# Altium schematic sheet MCU.SchDoc: ESP32 Web Radio
size A4; Engineer: CT; SheetNumber: 2; SheetTotal: 5; SPICEModelCacheVHZGYMXH: <root> / <DocumentId>VHZGYMXH</DocumentId> / </root>
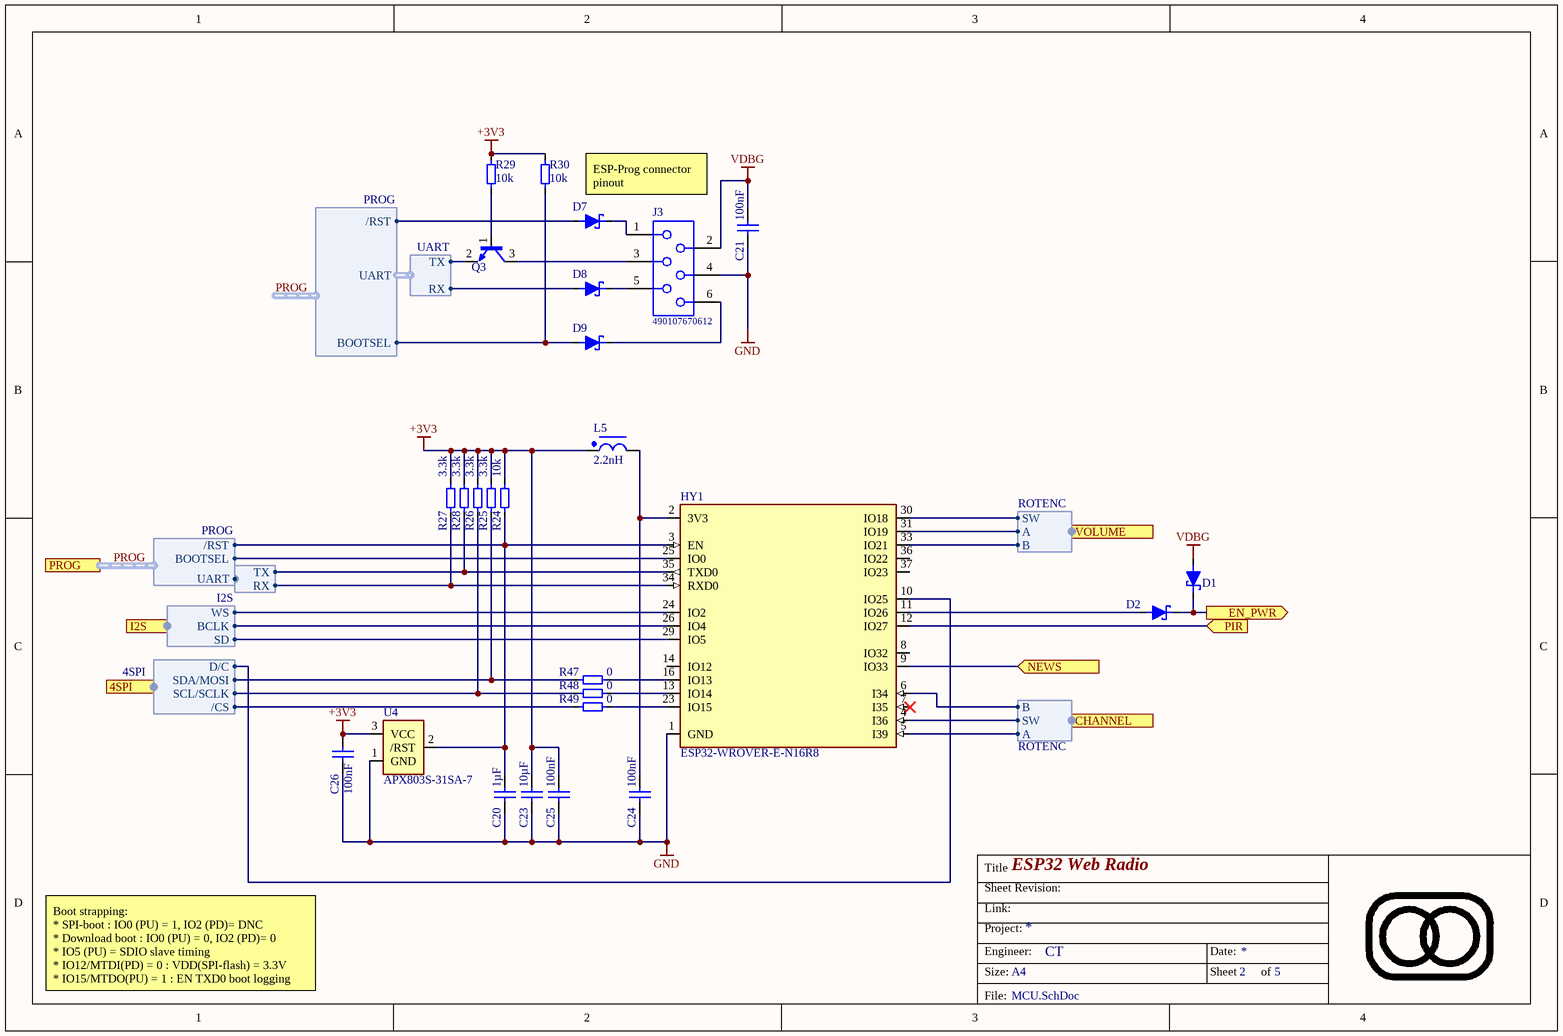
[diagram p0: MCU.SchDoc]

## Parts
C20  value 1µF  [0805-C-N]  (hidden comment: Capacitor 1µF +/-10% 10V X7R 0805)
C21  value 100nF  [0603-C-N]  (hidden comment: Capacitor 100nF +/-10% 50V X7R 0603)
C23  value 10µF  [1206-C-N]  (hidden comment: Capacitor 10µF +/-10% 10V X7R 1206)
C24  value 100nF  [0603-C-N]  (hidden comment: Capacitor 100nF +/-10% 50V X7R 0603)
C25  value 100nF  [0603-C-N]  (hidden comment: Capacitor 100nF +/-10% 50V X7R 0603)
C26  value 100nF  [0603-C-N]  (hidden comment: Capacitor 100nF +/-10% 50V X7R 0603)
D1  1PS79SB30,115  [FP-SOD523-MFG]  (value not drawn)
D2  1PS79SB30,115  [FP-SOD523-MFG]  (value not drawn)
D7  1PS79SB30,115  [FP-SOD523-MFG]  (value not drawn)
D8  1PS79SB30,115  [FP-SOD523-MFG]  (value not drawn)
D9  1PS79SB30,115  [FP-SOD523-MFG]  (value not drawn)
HY1  value ESP32-WROVER-E-N16R8  [ESP32 _WROVER]  (hidden comment: ESP32-WROVER-E(M213EH2864PH3Q0))
J3  490107670612  [490107670612_Debugging Application]  (no BOM)
L5  value 2.2nH  [FP-LQW18AN_10-MFG]  (hidden comment: LQW18AN2N2D10D)
Q3  BC846BLT1G  [SOT-23-3-N]  (value not drawn)
R24  value 10k  [0603-R-N]  (hidden comment: Resistor 10k +/-1% 50V 0603)
R25  value 3.3k  [0603-R-N]  (hidden comment: Resistor 3.3k +/-1% 50V 0603)
R26  value 3.3k  [0603-R-N]  (hidden comment: Resistor 3.3k +/-1% 50V 0603)
R27  value 3.3k  [0603-R-N]  (hidden comment: Resistor 3.3k +/-1% 50V 0603)
R28  value 3.3k  [0603-R-N]  (hidden comment: Resistor 3.3k +/-1% 50V 0603)
R29  value 10k  [0603-R-N]  (hidden comment: Resistor 10k +/-1% 50V 0603)
R30  value 10k  [0603-R-N]  (hidden comment: Resistor 10k +/-1% 50V 0603)
R47  value 0  [0603-R-N]  (hidden comment: Jumper 0R <50 mOhm 1A 0603)
R48  value 0  [0603-R-N]  (hidden comment: Jumper 0R <50 mOhm 1A 0603)
R49  value 0  [0603-R-N]  (hidden comment: Jumper 0R <50 mOhm 1A 0603)
U4  APX803S-31SA-7  [SOT-23-3-N]

## Ports
4SPI (harness 4SPI), CHANNEL (harness ROTENC), EN_PWR (out), I2S (harness I2S), NEWS (in), PIR (in), PROG (harness PROG), VOLUME (harness ROTENC)

## Harnesses
UART: RX, TX
PROG: /RST, UART, BOOTSEL
ROTENC: SW, A, B
4SPI: SDA/MOSI, SCL/SCLK, /CS, D/C
I2S: BCLK, WS, SD

## Nets
+3V3: C23.2 C25.2 C26.1 L5.1 R24.2 R25.1 R26.1 R27.1 R28.2 R29.2 R30.2 U4.3(VCC)
GND: C20.1 C21.1 C23.1 C24.1 C25.1 C26.2 HY1.1(GND) J3.4 U4.1(GND)
VDBG: C21.2 D1.2(A) J3.2
EN_PWR: D1.1(K) D2.1(K) ; port EN_PWR
NEWS: HY1.9(IO33) ; port NEWS
PIR: HY1.12(IO27) ; port PIR
PROG./RST: C20.2 D7.2(A) HY1.3(EN) R24.1 U4.2(/RST) ; port PROG./RST
PROG.BOOTSEL: D9.2(A) HY1.25(IO0) R30.1 ; port PROG.BOOTSEL
NetC24_2: C24.2 HY1.2(3V3) L5.2
NetD2_2: D2.2(A) HY1.11(IO26)
NetD7_1: D7.1(K) J3.1
NetD8_1: D8.1(K) J3.5
NetD8_2: D8.2(A) HY1.34(RXD0) R27.2 ; harness UART.RX
NetD9_1: D9.1(K) J3.6
NetHY1_4: HY1.4(I36) ; port CHANNEL.SW
NetHY1_5: HY1.5(I39) ; port CHANNEL.A
NetHY1_6: HY1.6(I34) ; port CHANNEL.B
NetHY1_10: HY1.10(IO25) ; port 4SPI.D/C
NetHY1_13: HY1.13(IO14) R48.1
NetHY1_16: HY1.16(IO13) R47.1
NetHY1_23: HY1.23(IO15) R49.1
NetHY1_24: HY1.24(IO2) ; port I2S.WS
NetHY1_26: HY1.26(IO4) ; port I2S.BCLK
NetHY1_29: HY1.29(IO5) ; port I2S.SD
NetHY1_30: HY1.30(IO18) ; port VOLUME.SW
NetHY1_31: HY1.31(IO19) ; port VOLUME.A
NetHY1_33: HY1.33(IO21) ; port VOLUME.B
NetHY1_35: HY1.35(TXD0) Q3.2(E) R28.1 ; harness UART.TX
NetJ3_3: J3.3 Q3.3(C)
NetQ3_1: Q3.1(B) R29.1
NetR25_2: R25.2 R47.2 ; port 4SPI.SDA/MOSI
NetR26_2: R26.2 R48.2 ; port 4SPI.SCL/SCLK
NetR49_2: R49.2 ; port 4SPI./CS

Not connected (* = marked no-connect by the designer): HY1 7(I35)* 8(IO32) 14(IO12) 36(IO22) 37(IO23)

## Buses and harness runs
harness PROG = port PROG

## Notes on the sheet
- ESP-Prog connector pinout
- Boot strapping:
  * SPI-boot : IO0 (PU) = 1, IO2 (PD)= DNC
  * Download boot : IO0 (PU) = 0, IO2 (PD)= 0
  * IO5 (PU) = SDIO slave timing
  * IO12/MTDI(PD) = 0 : VDD(SPI-flash) = 3.3V
  * IO15/MTDO(PU) = 1 : EN TXD0 boot logging
- Title
- Sheet Revision:
- Link:
- Size:
- Project:
- Engineer:
- A4
- Date:
- Sheet
- of
- File:

## Library data of the parts
C20 = CMP-072-000659-13: WCAP-CSGP Multilayer Ceramic Chip Capacitor, General Purpose, size 0805, X7R, 1µF, 10VDC; Tolerance: 10%; Capacitor Type: MLCC; Technical Reference: X7R0805105K010DFCT10000; Dissipation Factor: 5%; Insulation Resistance: 0.5GO; Case/Package: 0805; Source: WCAP-CSGP.SchLib; Width: 1.25mm; Pins: 2; ComponentLink2Description: Datasheet Link; Packaging: Tape and Reel; Match Code: WCAP-CSGP; Voltage Rating: 10V; Dielectric: X7R; Min Operating Temperature: -55°C; Mounting Technology: SMT; Max Operating Temperature: 125°C; ComponentLink1URL: https://www.we-online.com/redexpert/article/885012207022?ad; JLCPCB Part #: C28323; Height: 1.25mm; Design Item ID: 885012207022; Usage: General Purpose; ComponentLink1Description: Website Link; ComponentLink2URL: https://www.we-online.com/redexpert/spec/885012207022?ad; Length: 2mm
C21 C24-C26 = CMP-072-000619-13: WCAP-CSGP Multilayer Ceramic Chip Capacitor, General Purpose, size 0603, X7R, 100nF, 50VDC; Capacitor Type: MLCC; Tolerance: 10%; Dissipation Factor: 3%; Technical Reference: X7R0603104K050DFCT10000; Insulation Resistance: 5GO; Length: 1.6mm; Dielectric: X7R; Height: 0.8mm; Pins: 2; Min Operating Temperature: -55°C; Usage: General Purpose; Mounting Technology: SMT; Case/Package: 0603; Width: 0.8mm; Max Operating Temperature: 125°C; Voltage Rating: 50V; Design Item ID: 885012206095; ComponentLink1URL: https://www.we-online.com/redexpert/article/885012206095?ad; ComponentLink2URL: https://www.we-online.com/redexpert/spec/885012206095?ad; Packaging: Tape and Reel; ComponentLink1Description: Website Link; Match Code: WCAP-CSGP; ComponentLink2Description: Datasheet Link; Source: WCAP-CSGP.SchLib; JLCPCB Part #: C14663
C23 = CMP-072-000777-12: WCAP-CSGP Multilayer Ceramic Chip Capacitor, General Purpose, size 1206, X7R, 10µF, 10VDC; Dissipation Factor: 10%; Insulation Resistance: 0.01GO; Capacitor Type: MLCC; Technical Reference: X7R1206106K010DFCT10000; Width: 1.6mm; Source: WCAP-CSGP.SchLib; ComponentLink2URL: https://www.we-online.com/redexpert/spec/885012208018?ad; Tolerance: 10%; Packaging: Tape and Reel; Voltage Rating: 10V; ComponentLink2Description: Datasheet Link; Usage: General Purpose; Design Item ID: 885012208018; Pins: 2; Max Operating Temperature: 125°C; Height: 1.6mm; ComponentLink1URL: https://www.we-online.com/redexpert/article/885012208018?ad; Dielectric: X7R; Case/Package: 1206; ComponentLink1Description: Website Link; Min Operating Temperature: -55°C; Length: 3.2mm; Match Code: WCAP-CSGP; Mounting Technology: SMT; JLCPCB Part #: C97953
D1 D2 D7-D9 = CMP-004-00048-7: VR=40V IF=200mA 20pF; Forward Voltage: 600 mV @ 200 mA; Forward Current: 200mA; Max Repetitive Reverse Voltage (Vrrm): 40V; Case/Package: SOD-523; JLCPCB Part #: C426690; RoHS Compliant: Yes
HY1 = CMP-019-000003-20: old part nr : M213EH2864PH3Q0, new part nr : ESP32-WROVER-E-N16R8; pin to pad: 1>1+15+38+39; Component Type: Standard; Pin Count: 39; Source: 7c7_Modules.SchLib; Design Item ID: ESP32_WROVER; JLCPCB Part #: C529589
J3 = CMP-002-000028-9: WR-WST REDFIT IDC SKEDD, pitch 2.54mm, 6pins; Contact Resistance max.: 10mOhm; Gender: Transition; Rated Current: 1A; Pin Number: 6; Working Voltage: 100V(AC); Connector Type: Cable,IDC; Design Item ID: 490107670612; Source: WR-WST.SchLib; Packaging: Tube; ComponentLink2Description: Datasheet; Part Number: 490107670612; ComponentLink1Description: Manufacturer; Operating Temperature: -25 to +105degC; Pitch: 2.54mm; ComponentLink1URL: http://www.we-online.de; Published Date: November 2019; Mounting Technology: Press-In; Publisher: Wurth Elektronik; ComponentLink2URL: https://katalog.we-online.com/em/datasheet/490107670612.pdf; RoHS Compliant: Yes; Contact Plating: Gold; Series: REDFIT WR-WST
L5 = CMP-006-00039-1: Inductor RF Chip Wirewound 2.2nH 0.5nH 100MHz 25Q-Factor 1.4A 18mOhm DCR 0603 Paper T/R; Q Factor: 25; Self Resonant Frequency: 18GHz; Current: 1A; DC Resistance (DCR): 18mR; Shielding: Unshielded; Core Material: Non-Magnetic,Air; Weight: 0.000106oz; Case/Package: 0603; Mounting Technology: Surface Mount; Package Quantity: 1; Lead Free: Lead Free; Case Code (Imperial): 0603; Test Frequency: 100MHz; Width: 0.8mm; Min Operating Temperature: -55°C; Depth: 1.1mm; Termination: SMD/SMT; Series: LQW18A_10; Max Operating Temperature: 125°C; DC Current: 1.4A; JLCPCB Part #: C701164; Length: 1.6mm; Max Current Rating: 1.4A; Packaging: Tape and Reel; Case Code (Metric): 1608; RoHS Compliant: Yes; Radiation Hardening: No; Height: 0.8mm; Military Standard: Not; Max DC Current: 1.4A
Q3 = CMP-013-00048-14: NPN Ic=100mA Vceo=65V hfe=200~450 P=225mW SOT-23; Ic Max: 100mA; Vce Max: 65V; Transistor Type: NPN; Case/Package: SOT-23-3; JLCPCB Part #: C82477
R24 R29 R30 = CMP-009-00017-23: Chip Resistor, Thick Film, General Purpose, 0603, 100mW, 50V, 10 kOhm, +/-1%; Tolerance: 1%; Elements: 1; Power Rating: 100mW; RoHS Compliant: True; Voltage Rating: 50V; Mounting Technology: SMT; Usage: General Purpose; JLCPCB Part #: C25804; Max Operating Temperature: 155°C; Case/Package: 0603; Pins: 2; Resistor Type: Thick Film; Min Operating Temperature: -55°C
R25-R28 = CMP-009-00243-14: Chip Resistor, Thick Film, General Purpose, 0603, 100mW, 50V, 3.3 kOhm, +/-1%; Tolerance: 1%; Elements: 1; Power Rating: 100mW; Voltage Rating: 50V; RoHS Compliant: Yes; Usage: General Purpose; Max Operating Temperature: 155°C; Mounting Technology: SMT; Min Operating Temperature: -55°C; Case/Package: 0603; Pins: 2; Resistor Type: Thick Film; JLCPCB Part #: C22978
R47-R49 = CMP-009-00006-22: Chip Jumper, Thick Film, Jumper, 0603, 100mW, 1A, 0 Ohm, <50 mOhm; Tolerance: 50 mOhm; Elements: 1; Voltage Rating: 75V; Mounting Technology: SMT; Usage: Jumper; Max Operating Temperature: 155°C; Pins: 2; Case/Package: 0603; JLCPCB Part #: C21189; Current Rating: 1A; Power Rating: 100mW; RoHS Compliant: True; Min Operating Temperature: -55°C; Resistor Type: Thick Film
U4 = CMP-019-00095-1: Processor Supervisor 3.08V 1 Active Low/Open Drain 3-Pin SOT-23 T/R; Number of Voltages Monitored: 1; Reset Timeout: 140ms; Type: Simple Reset/Power-On Reset; Threshold Voltage: 3.08V; Packaging: Cut Tape; JLCPCB Part #: C129757; Case/Package: TO-236-3; Reset: Active Low; Max Operating Temperature: 85°C; RoHS Compliant: Yes; Series: -; Min Operating Temperature: -40°C; Mounting Technology: Surface Mount